# EAGLE design pwr (EAGLE 6.1)
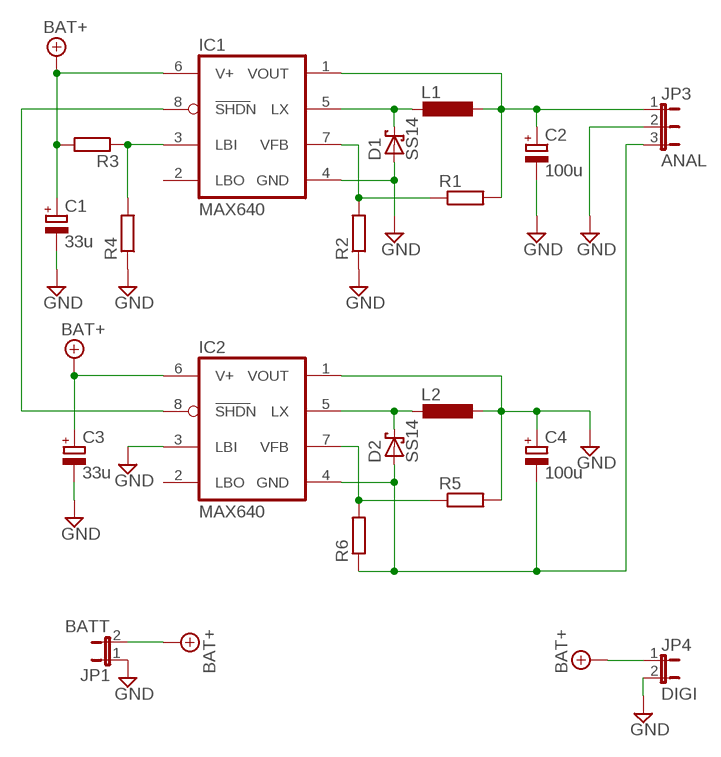
[diagram p0: schematic, sheet 1]

## Parts
C1  33u  CPOL-EUSMCC  [SMC_C]
C2  100u  CPOL-EUSMCC  [SMC_C]
C3  33u  CPOL-EUSMCC  [SMC_C]
C4  100u  CPOL-EUSMCC  [SMC_C]
D1  SS14  [SMA]
D2  SS14  [SMA]
IC1  MAX640  [SO08]
IC2  MAX640  [SO08]
JP1  BATT  JP1E  [JP1]
JP3  ANAL  JP2E  [JP2]
JP4  DIGI  JP1E  [JP1]
L1  L-EUWE-TPC  [POWER-CHOKE_WE-TPC]
L2  L-EUWE-TPC  [POWER-CHOKE_WE-TPC]
R1  R-EU_R0805  [R0805]
R2  R-EU_R0805  [R0805]
R3  R-EU_R0805  [R0805]
R4  R-EU_R0805  [R0805]
R5  R-EU_R0805  [R0805]
R6  R-EU_R0805  [R0805]

## Nets
+2V5: C2.+ IC1.1(VOUT) JP3.1 L1.1 R1.2
-2V5: C4.- D2.A IC2.4(GND) JP3.3 R6.1
GND: C1.- C2.- C3.- C4.+ D1.A IC1.4(GND) IC2.1(VOUT) IC2.3(LBI) JP1.1 JP3.2 JP4.2 L2.1 R2.1 R4.1 R5.2
N$1: D1.C IC1.5(LX) L1.2
N$4: D2.C IC2.5(LX) L2.2
N$6: IC1.3(LBI) R3.1 R4.2
N$8: IC1.7(VFB) R1.1 R2.2
N$10: IC2.7(VFB) R5.1 R6.2
SHDN: IC1.8(SHDN) IC2.8(SHDN)
VBAT: C1.+ C3.+ IC1.6(V+) IC2.6(V+) JP1.2 JP4.1 R3.2 ; supply symbol labelled BAT+
Unconnected: IC1.2(LBO) IC2.2(LBO)

## Library data of the parts
C1-C4 = rcl:CPOL-EU: POLARIZED CAPACITOR, European symbol
D1 D2 = mindspy:SS14
IC1 IC2 = mindspy:MAX640
JP1 JP4 = jumper:JP1E: JUMPER
JP3 = jumper:JP2E: JUMPER
L1 L2 = rcl:L-EU: INDUCTOR, European symbol
R1-R6 = rcl:R-EU_: RESISTOR, European symbol

## Board
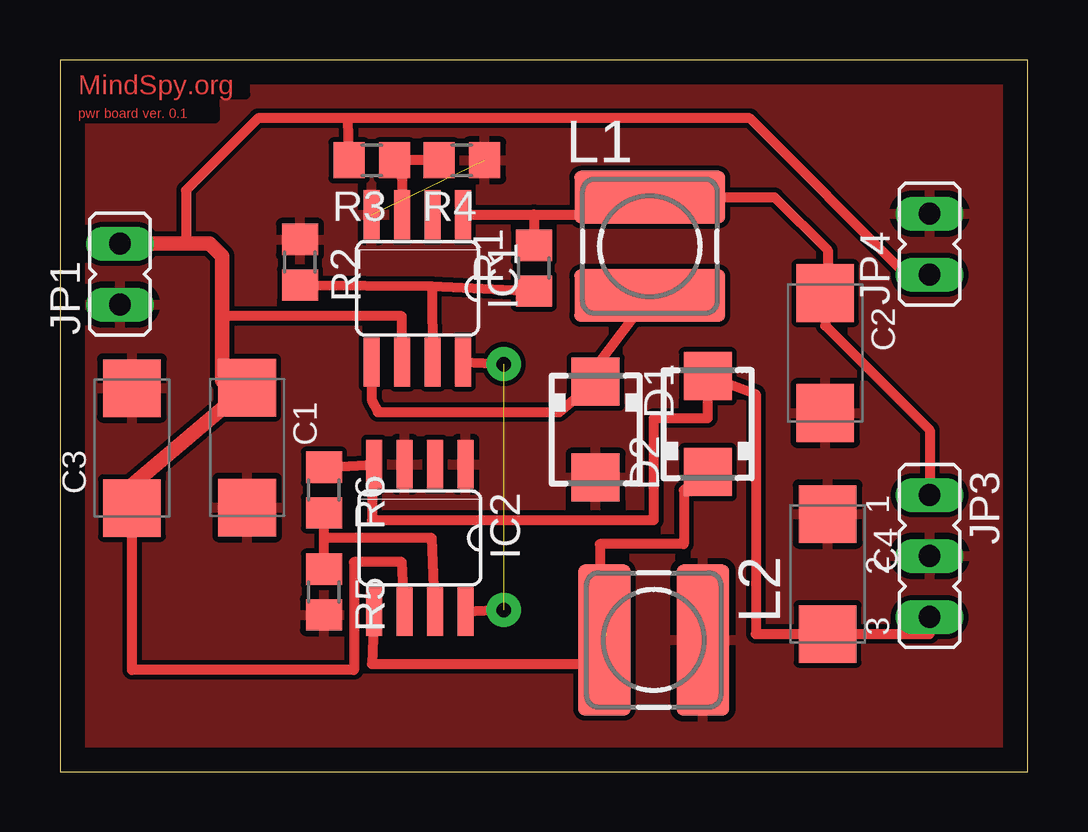
[diagram p1: board, top side]

Size 40.35 x 29.68 mm. Coordinates in mm from the lower left corner, seen from the top.
Outline: 0,0 40.35,0 40.35,29.68 0,29.68 0,0
Copper layers (1*16): Top 0.035mm / dielectric 1.5mm / Bottom 0.035mm
Design rules: minimum track width 10mil, minimum drill 24mil, track to track 8mil, track to pad 8mil, pad to pad 8mil, via to via 8mil, smd to smd 8mil, copper to edge 40mil, drill to drill 8mil, minimum pad ring 10mil, minimum via ring 8mil, stop-mask expansion 4mil, vias tented up to drill 0mil, thermal gap 10mil

### Footprints (pad centres in the part's own frame; a part is rotated, then mirrored left to right if it is on the bottom)
SMC_C = smd 2.4 x 2.4: + -2.5,0; - 2.5,0
SMA = smd 2 x 2: A 2,0; C -2,0
SO08 = smd 0.66 x 2.032: 1 -1.905,-3.073; 2 -0.635,-3.073; 3 0.635,-3.073; 4 1.905,-3.073; 5 1.905,3.073; 6 0.635,3.073; 7 -0.635,3.073; 8 -1.905,3.073
JP1 = drill 0.914 long: 1 0,-1.27; 2 0,1.27
JP2 = drill 0.914 long: 1 -2.54,0; 2 0,0; 3 2.54,0
POWER-CHOKE_WE-TPC = smd 6.3 x 2.2: 1 0,2.05; 2 0,-2.05
R0805 = smd 1.3 x 1.5: 1 -0.95,0; 2 0.95,0

### Placement (x,y rotation side)
C1  7.8,13.52 270 top
C2  31.9,17.46 270 top
C3  3,13.5 90 top
C4  32,8.25 270 top
D1  22.33,14.27 270 top
D2  27,14.5 90 top
IC1  14.9,20.16 180 top
IC2  15,9.75 180 top
JP1  2.5,20.75 0 top
JP3  36.25,9 270 top
JP4  36.25,22 0 top
L1  24.59,21.91 0 top
L2  24.75,5.5 270 top
R1  19.75,21 90 top
R2  10,21.25 270 top
R3  13,25.5 180 top
R4  16.75,25.5 180 top
R5  11,7.5 270 top
R6  11,11.75 270 top

### Tracks (layer width: path | path; a pad name or v marks a point on that pad's centre or on a via)
+2V5
  Top 0.406: JP3.1 36.25,14.25 31.9,18.6 C2.+ 32,20.06 32,21.75 29.79,23.96 L1.1 23.86,23.23 IC1.1 19.75,23.25 R1.2
-2V5
  Top 0.406: JP3.3 36.25,5.75 C4.- 29,5.75 29,15.75 D2.A 27,14.75 24.75,14.75 24.75,10.5 13,10.5 13,12.82 IC2.4 R6.1
GND  (1 unrouted)
  pour Top: -2,30.5 41.5,30.5 41.5,-1 -2,-1
N$1
  Top 0.406: IC1.5 12.99,15.51 13.25,15 20.81,15 D1.C 22.33,16.85 L1.2
N$4  (1 unrouted)
  Top 0.406: 13,6.68 IC2.5 13,4.5 23,4.5 22.75,5.75 22.5,5.75 22.5,9.5 26,9.5 26,11.75 D2.C
N$6
  Top 0.406: IC1.3 14.25,24.75 R3.1 R4.2
N$8
  Top 0.406: R2.2 15.5,20.25 | 15.5,20.25 IC1.7 | 19.75,20.25 R1.1 | R1.1 19.75,20 | 15.5,20.25 R1.1
N$10
  Top 0.406: R5.1 11,9.75 | 11,9.75 R6.2 11,11 | IC2.7 15.5,9.75 11,9.75
SHDN  (via drill 0.6 pad 1.42)  (1 unrouted)
  Top 0.406: IC1.8 v18.5,17 | v18.5,6.75 IC2.8
VBAT
  Top 0.406: JP4.1 35.27,20.73 28.75,27.25 12,27.25 | 12,27.25 8.25,27.25 5.25,24.25 5.25,22.02 | R3.2 12,27.25 | IC1.6 14.25,19 6.75,19 | IC2.6 14.25,8.75 12.25,8.75 12.25,4.25 3,4.25 C3.+
  Top 0.61: C3.+ 3,11.97 C1.+ 6.75,16.32 6.75,19 6.75,21.5 6.23,22.02 5.25,22.02 JP1.2

### Text on the board
Top: MindSpy.org | pwr board ver. 0.1
Reference: BAT+